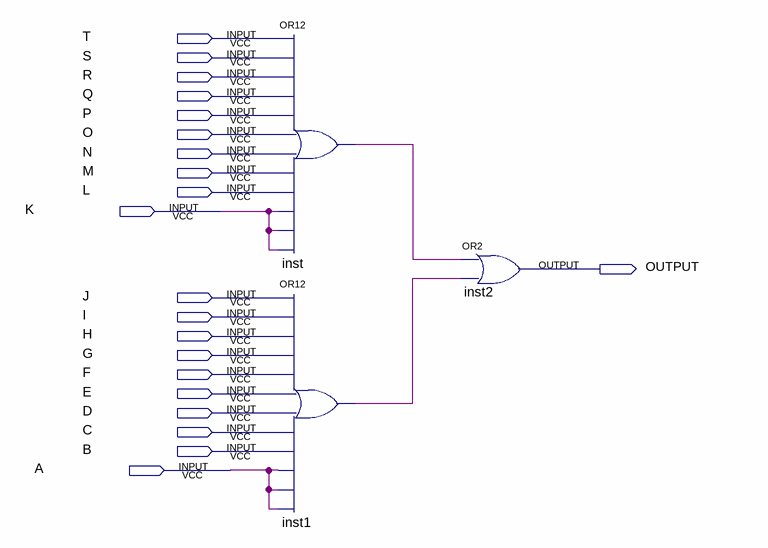
[diagram p0: schematic sheet]
// Quartus schematic OR20.bdf as structural Verilog: 3 symbols, 21 pins
module OR20 (
  input  T,
  input  S,
  input  R,
  input  Q,
  input  P,
  input  O,
  input  N,
  input  M,
  input  L,
  input  K,
  input  J,
  input  I,
  input  H,
  input  G,
  input  F,
  input  E,
  input  D,
  input  C,
  input  B,
  input  A,
  output OUTPUT
);

  wire inst1_out, inst_out;

  or inst (inst_out, T, S, R, Q, P, O, N, M, L, K, K, K);
  or inst1 (inst1_out, J, I, H, G, F, E, D, C, B, A, A, A);
  or inst2 (OUTPUT, inst_out, inst1_out);
endmodule
